# Altium schematic sheet LEDElement.SchDoc
size A3
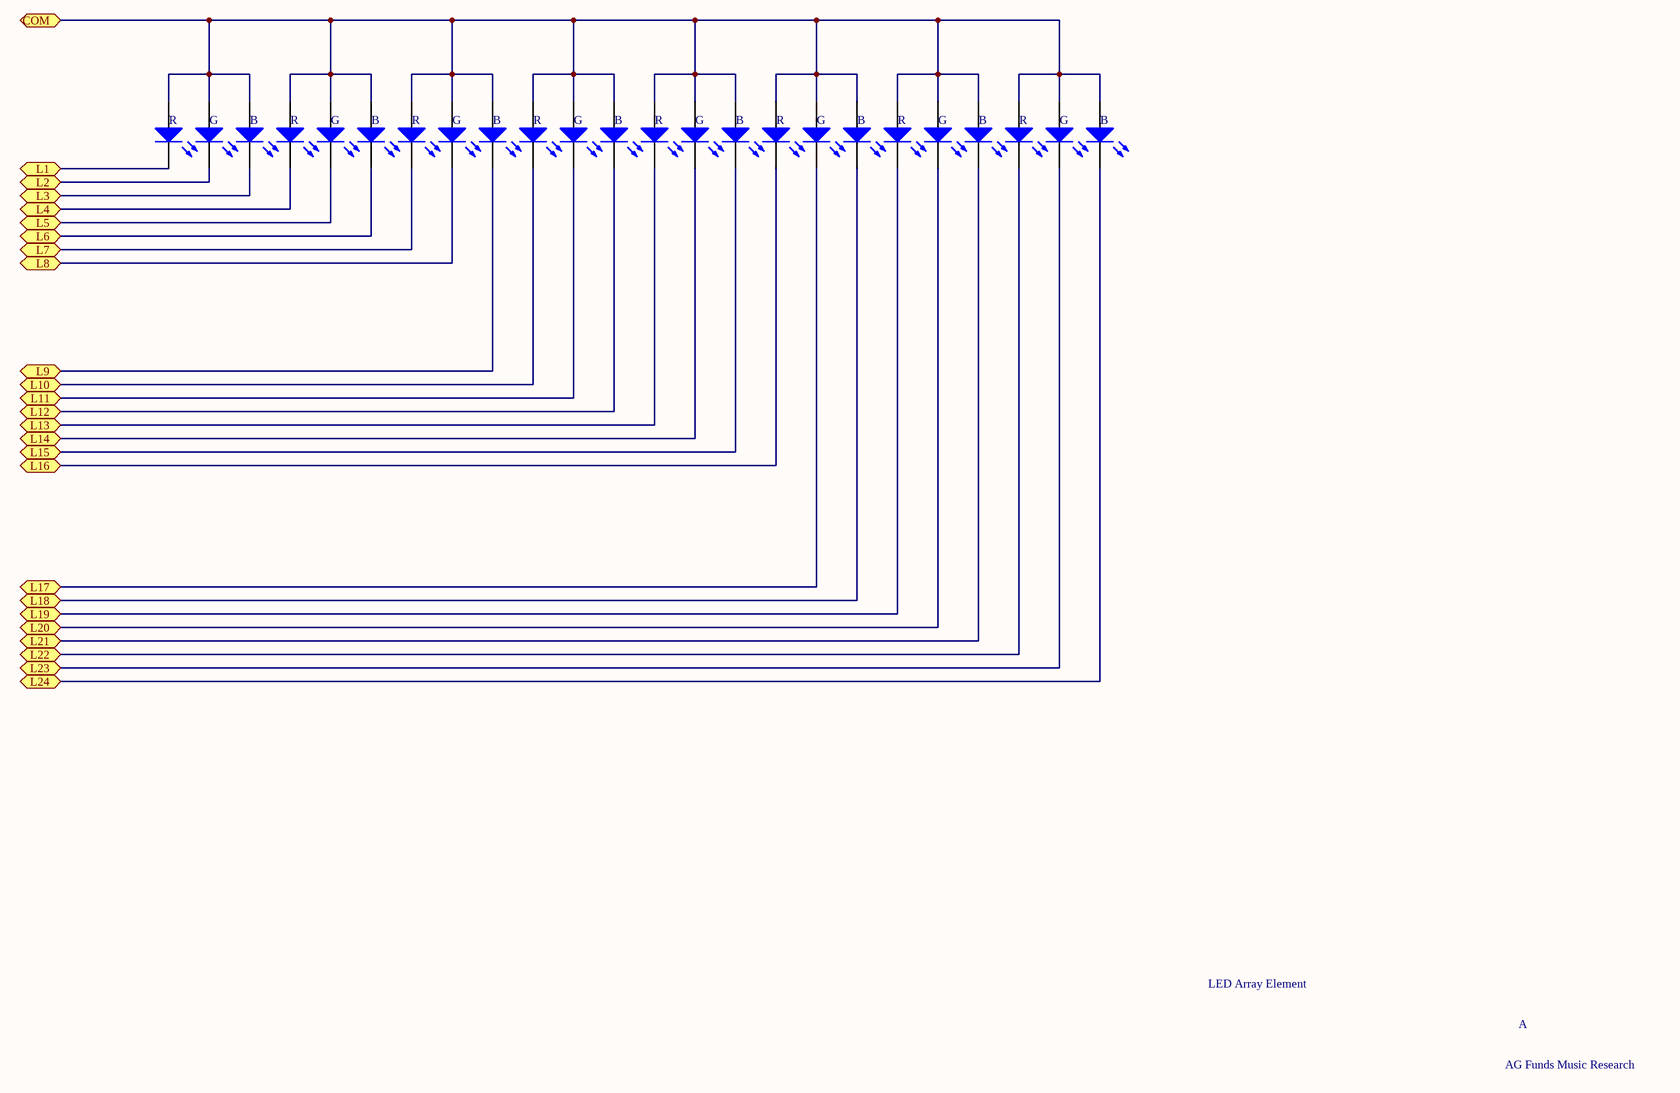
[diagram p0: LEDElement.SchDoc]

## Parts
LED1  5050RGBLED  [5050 cRGBLED]  (value not drawn)
LED2  5050RGBLED  [5050 cRGBLED]  (value not drawn)
LED3  5050RGBLED  [5050 cRGBLED]  (value not drawn)
LED4  5050RGBLED  [5050 cRGBLED]  (value not drawn)
LED5  5050RGBLED  [5050 cRGBLED]  (value not drawn)
LED6  5050RGBLED  [5050 cRGBLED]  (value not drawn)
LED7  5050RGBLED  [5050 cRGBLED]  (value not drawn)
LED8  5050RGBLED  [5050 cRGBLED]  (value not drawn)

## Ports
COM, L1, L2, L3, L4, L5, L6, L7, L8, L9, L10, L11, L12, L13, L14, L15, L16, L17, L18, L19, L20, L21, L22, L23, L24

## Nets
COM: LED1.1(A) LED1.3(A) LED1.5(A) LED2.1(A) LED2.3(A) LED2.5(A) LED3.1(A) LED3.3(A) LED3.5(A) LED4.1(A) LED4.3(A) LED4.5(A) LED5.1(A) LED5.3(A) LED5.5(A) LED6.1(A) LED6.3(A) LED6.5(A) LED7.1(A) LED7.3(A) LED7.5(A) LED8.1(A) LED8.3(A) LED8.5(A) ; port COM
L1: LED1.6(K) ; port L1
L2: LED1.4(K) ; port L2
L3: LED1.2(K) ; port L3
L4: LED2.6(K) ; port L4
L5: LED2.4(K) ; port L5
L6: LED2.2(K) ; port L6
L7: LED3.6(K) ; port L7
L8: LED3.4(K) ; port L8
L9: LED3.2(K) ; port L9
L10: LED4.6(K) ; port L10
L11: LED4.4(K) ; port L11
L12: LED4.2(K) ; port L12
L13: LED5.6(K) ; port L13
L14: LED5.4(K) ; port L14
L15: LED5.2(K) ; port L15
L16: LED6.6(K) ; port L16
L17: LED6.4(K) ; port L17
L18: LED6.2(K) ; port L18
L19: LED7.6(K) ; port L19
L20: LED7.4(K) ; port L20
L21: LED7.2(K) ; port L21
L22: LED8.6(K) ; port L22
L23: LED8.4(K) ; port L23
L24: LED8.2(K) ; port L24

## Notes on the sheet
- LED Array Element
- A
- AG Funds Music Research
- (in symbol 5050RGBLED) R; G; B

## Library data of the parts
LED1-LED8 = 5050RGBLED: 5050 RGB LED; Published: 8-Jun-2000; LatestRevisionDate: 08-Jul-2005; LatestRevisionNote: Mech Layer 1 removed.; PackageReference: LED-0; Publisher: Altium Limited; PackageDescription: LED; 2 Leads